# Altium schematic sheet Sheet2 - Filters.SchDoc
size A; DrawnBy: Isaac Rex